# EAGLE design Adafruit CP2104 Friend (EAGLE 6.4)
COMPANY: ADAFRUIT INDUSTRIES; DRAWN: KTOWN; REV: A
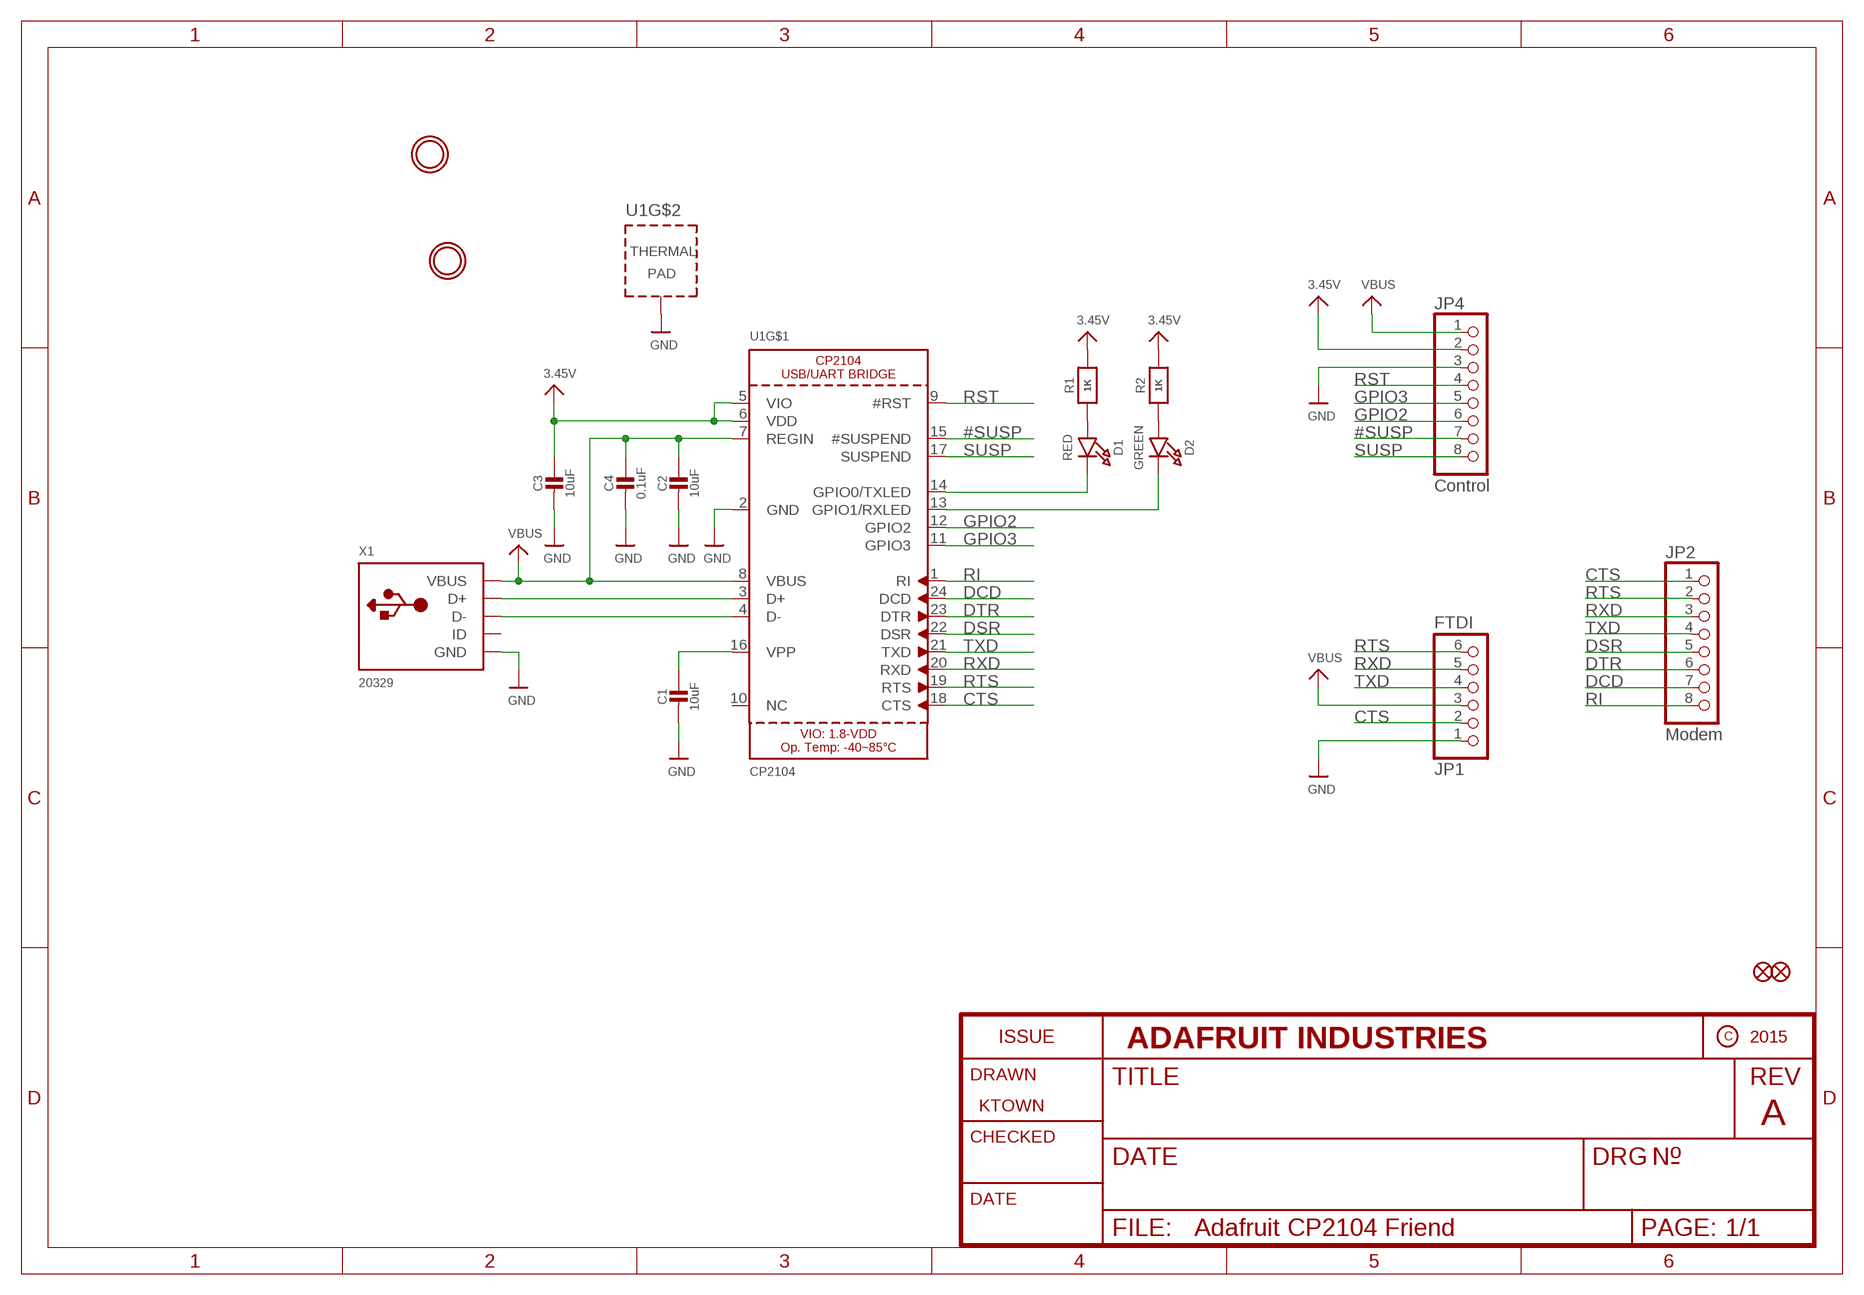
[diagram p0: schematic, sheet 1]

## Parts
C1  10uF  CAP_CERAMIC0805-NOOUTLINE  [0805-NO]
C2  10uF  CAP_CERAMIC0805-NOOUTLINE  [0805-NO]
C3  10uF  CAP_CERAMIC0805-NOOUTLINE  [0805-NO]
C4  0.1uF  CAP_CERAMIC0805-NOOUTLINE  [0805-NO]
D1  RED  LED0805_NOOUTLINE  [CHIPLED_0805_NOOUTLINE]
D2  GREEN  LED0805_NOOUTLINE  [CHIPLED_0805_NOOUTLINE]
FID1  FIDUCIAL""  [FIDUCIAL_1MM]
FID2  FIDUCIAL""  [FIDUCIAL_1MM]
JP1  FTDI  HEADER-1X676MIL  [1X06_ROUND_76]
JP2  Modem  HEADER-1X870MIL  [1X08_ROUND_70]
JP4  Control  HEADER-1X870MIL  [1X08_ROUND_70]
R1  1K  RESISTOR0805_NOOUTLINE  [0805-NO]
R2  1K  RESISTOR0805_NOOUTLINE  [0805-NO]
U1  CP2104  [QFN24_4MM_SMSC]
U$18  MOUNTINGHOLE2.0  [MOUNTINGHOLE_2.0_PLATED]
U$19  MOUNTINGHOLE2.0  [MOUNTINGHOLE_2.0_PLATED]
X1  20329  USB_MICRO_20329_V2  [4UCONN_20329_V2]

## Nets
3.3V: C3.1 JP4.2 R1.2 R2.2 U1.5(VIO) U1.6(VDD) ; supply symbol labelled 3.45V
#SUSP: JP4.7 U1.15(#SUSPEND)
CTS: JP1.2 JP2.1 U1.18(CTS)
DCD: JP2.7 U1.24(DCD)
DSR: JP2.5 U1.22(DSR)
DTR: JP2.6 U1.23(DTR)
GND: C1.2 C2.2 C3.2 C4.2 JP1.1 JP4.3 U1.2(GND) U1.THERM(TP) X1.BASE@1(GND) X1.BASE@2(GND) X1.GND X1.SPRT@1(GND) X1.SPRT@2(GND) X1.SPRT@3(GND) X1.SPRT@4(GND)
GPIO2: JP4.6 U1.12(GPIO2)
GPIO3: JP4.5 U1.11(GPIO3)
N$1: D1.A R1.1
N$2: U1.3(D+) X1.D+
N$3: U1.4(D-) X1.D-
N$4: C1.1 U1.16(VPP)
N$5: D2.A R2.1
N$6: D1.C U1.14(GPIO0/TXLED)
N$7: D2.C U1.13(GPIO1/RXLED)
RI: JP2.8 U1.1(RI)
RST: JP4.4 U1.9(#RST)
RTS: JP1.6 JP2.2 U1.19(RTS)
RXD: JP1.5 JP2.3 U1.20(RXD)
SUSP: JP4.8 U1.17(SUSPEND)
TXD: JP1.4 JP2.4 U1.21(TXD)
VBUS: C2.1 C4.1 JP1.3 JP4.1 U1.7(REGIN) U1.8(VBUS) X1.VBUS
Unconnected: U1.10(NC) X1.ID

## Library data of the parts
C1-C4 = microbuilder:CAP_CERAMIC: Ceramic Capacitors For new designs, use the packages preceded by an '_' character since they are more reliable: The following footprints should be used on most boards: _0402 - Standard footprint for regular board layouts _0603 - Standard footprint for regular board layouts _0805 - Standard footprint for regular board layouts _1206 - Standard footprint for regular board layouts For extremely tight-pitch boards where space is at a premium, the following 'micro-pitch' footprints can be used (smaller pads, no silkscreen outline, etc.): _0402MP - Micro-pitch footprint for very dense/compact boards _0603MP - Micro-pitch footprint for very dense/compact boards _0805MP - Micro-pitch footprint for very dense/compact boards _1206MP - Micro-pitch footprint for very dense/compact boards
D1 D2 = microbuilder:LED: LED 0603 - 0603 Surface Mount Package 2mA: Green LED - Low Power (3.9mcd, 2ma, 1.7Vf) - Digikey: 475-2709-2-ND Orange LED - Low Power (9.8mcd, 2ma, 1.8Vf) - Digikey: 475-1194-2-ND Red LED - Low Power (5mcd, 2ma, 1.8Vf) - Digikey: 475-1195-2-ND Yellow LED - Low Power (7mcd, 2ma, 1.8Vf) - Digikey: 475-1196-2-ND 5mA: Blue LED - Low Power (17mcd, 5ma, 2.9Vf) - Digikey: LNJ937W8CRACT-ND 0805 - 0805 Surface Mount Package 2mA: Red LED (8.8mcd, 2mA, 1.8Vf, Clear) - Low Power [Digikey: 475-2510-1-ND] Green LED (5mcd, 2mA, 1.8Vf, Clear) - Low Power [Digikey: 475-2730-1-ND] Yellow LED (11.3mcd, 2mA, 1.8Vf, Clear) - Low Power [Digikey: 475-2555-1-ND] 20mA: Red LED (104mcd, 20mA, Diffused) - LS R976 [Digikey: 475-1278-6-ND] Red LED (12mcd, 20mA, 2.0Vf, Clear) - APT2012EC [Digikey: 754-1128-1-ND] Green LED (15mcd, 20mA, 2.2Vf, Clear) - APT2012GC [Digikey: 754-1131-1-ND] Orange LED (160mcd, 20mA, 2.1Vf, Clear) - APT2012SECK [Digikey: 754-1130-1-ND] 1206 - 1206 Surface Mount Package Green LED (26mcd, 20mA, Diffused) - LG N971 [Digikey: 475-1407-6-ND] Red LED (15mcd, 20mA, Diffused) - LH N974 [Digikey: 475-1416-6-ND] Cree - Cree High-Power Surface Mount LEDs XPEBWT-L1-0000-00D50 - White 111lm 350mA 2.9Vf 6200K 110° XTEAWT-00-0000-00000LEE3 - White 114lm 350mA 2.85Vf 5000K 115° Everlight - Everlight 45-21 Series Surface Mount LEDs 45-21/QK2C-B2832AC2CB2/2T - Warm White 2000mcd 20mA 3.25Vf 3050K 120° 45-21/LK2C-B38452C4CB2/2T - Nuetral White 2000mcd 20mA 3.25Vf 4150K 120° 45-21/LK2C-B50634C6CB2/2T - Cold White 2200mcd 20mA 3.25Vf 5650K 120° PLCC2 Reverse Mount LS T77K-J1L2-1-0-2-R18-Z - Red 11.25mcd 2mA 1.8Vf 630nm 120° LO T77K-L1M2-24-Z - Orange 19.6mcd 2mA 1.8Vf 606nm 120° LY T77K-K2M1-26-Z - Yellow 15.7mcd 2mA 1.8Vf 587nm 120°
FID1 FID2 = microbuilder:FIDUCIAL: Fiducial Alignment Points Various fiducial points for machine vision alignment.; BOM: EXCLUDE
JP1 = microbuilder:HEADER-1X6: PIN HEADER
JP2 JP4 = microbuilder:HEADER-1X8: PIN HEADER
R1 R2 = microbuilder:RESISTOR: Resistors For new designs, use the packages preceded by an '_' character since they are more reliable: The following footprints should be used on most boards: _0402 - Standard footprint for regular board layouts _0603 - Standard footprint for regular board layouts _0805 - Standard footprint for regular board layouts _1206 - Standard footprint for regular board layouts For extremely tight-pitch boards where space is at a premium, the following 'micro-pitch' footprints can be used (smaller pads, no silkscreen outline, etc.): _0402MP - Micro-pitch footprint for very dense/compact boards _0603MP - Micro-pitch footprint for very dense/compact boards _0805MP - Micro-pitch footprint for very dense/compact boards _1206MP - Micro-pitch footprint for very dense/compact boards
U1 = microbuilder:CP2104: CP2104 - USB to UART Bridge VDD Output: 3.45V
U$18 U$19 = microbuilder:MOUNTINGHOLE: Mounting Hole For #2 screws (0.086"/2.18mm width, 0.094"/2.4mm hole) use 2.5mm; BOM: EXCLUDE
X1 = microbuilder:USB: USB Connectors USBMINIB - Surface Mount Female Mini-B USB Connector 4UConnector: 06564

## Board
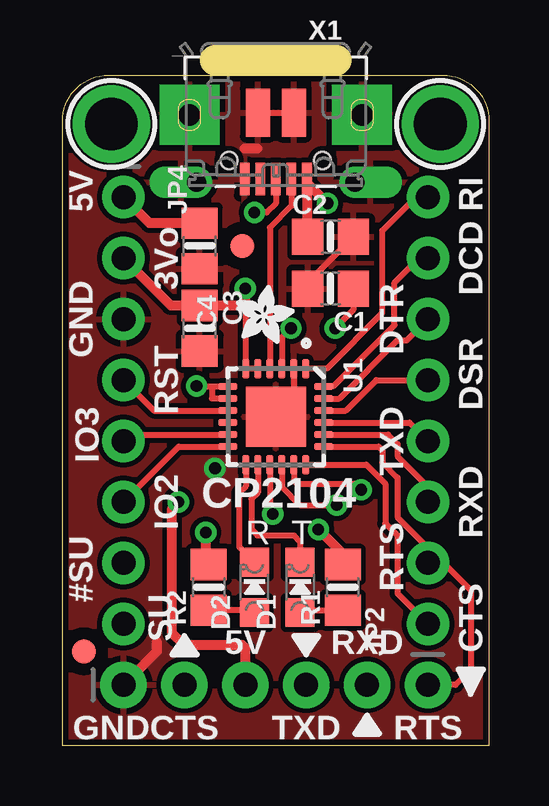
[diagram p1: board, top side]
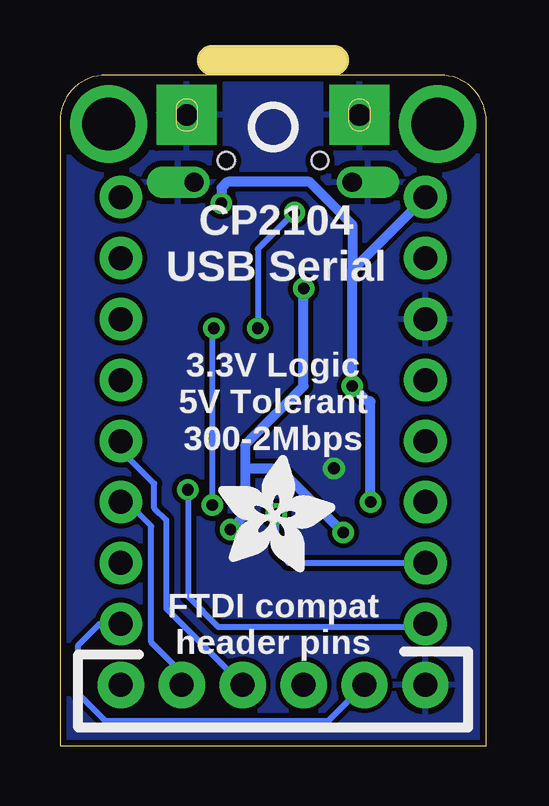
[diagram p2: board, bottom side, seen from below]

Size 17.78 x 28.57 mm. Coordinates in mm from the lower left corner, seen from the top.
Outline: 6.35,28.57 11.43,28.57
Outline: 0,0 0,26.04 arc-90 1.91,27.94 15.88,27.94 arc-90 17.78,26.04 17.78,0 0,0
Copper layers (1*16): Top 0.035mm / dielectric 1.5mm / Bottom 0.035mm
Design rules "adafruit *": minimum track width 8mil, minimum drill 15.5mil, track to track 8mil, track to pad 8mil, pad to pad 8mil, via to via 8mil, smd to smd 8mil, copper to edge 10mil, drill to drill 8mil, minimum pad ring 10mil, minimum via ring 8mil, stop-mask expansion 2mil, vias tented up to drill 20mil, thermal gap 10mil

### Footprints (pad centres in the part's own frame; a part is rotated, then mirrored left to right if it is on the bottom)
0805-NO = smd 1.3 x 1.5: 1 -0.95,0; 2 0.95,0
CHIPLED_0805_NOOUTLINE = smd 1.2 x 1.2: A 0,-1.05; C 0,1.05
FIDUCIAL_1MM = smd 1 x 1: 1 0,0
1X06_ROUND_76 = drill 1 pad 1.93: 1 -6.35,0; 2 -3.81,0; 3 -1.27,0; 4 1.27,0; 5 3.81,0; 6 6.35,0
1X08_ROUND_70 = drill 1 pad 1.778: 1 -8.89,0; 2 -6.35,0; 3 -3.81,0; 4 -1.27,0; 5 1.27,0; 6 3.81,0; 7 6.35,0; 8 8.89,0
QFN24_4MM_SMSC = smd 0.8 x 0.28: 1 -2,1.25; 2 -2,0.75; 3 -2,0.25; 4 -2,-0.25; 5 -2,-0.75; 6 -2,-1.25; 13 2,-1.25; 14 2,-0.75; 15 2,-0.25; 16 2,0.25; 17 2,0.75; 18 2,1.25 | smd 0.28 x 0.8: 7 -1.25,-2; 8 -0.75,-2; 9 -0.25,-2; 10 0.25,-2; 11 0.75,-2; 12 1.25,-2; 19 1.25,2; 20 0.75,2; 21 0.25,2; 22 -0.25,2; 23 -0.75,2; 24 -1.25,2 | smd 2.5 x 2.5: THERM 0,0
MOUNTINGHOLE_2.0_PLATED = drill 2.2 pad 3: P$1 0,0
4UCONN_20329_V2 = smd 1 x 2: BASE@1 -0.75,-2; BASE@2 0.75,-2 | smd 0.4 x 1.35: D+ 0,0.775; D- -0.65,0.775; GND 1.3,0.775; ID 0.65,0.775; VBUS -1.3,0.775 | drill 0.8 pad 1.2 offset: SPRT@1 -3.3,0.9; SPRT@2 3.3,0.9 | drill 0.9 pad 2.5 square: SPRT@3 -3.6,-1.9; SPRT@4 3.6,-1.9 | hole 0.7: -1.95,0; 1.95,0

### Placement (x,y rotation side)
C1  11.18,19.05 180 top
C2  11.18,21.21 0 top
C3  5.71,17.4 270 top
C4  5.71,20.83 270 top
D1  9.91,6.6 0 top
D2  8,6.6 0 top
FID1  0.89,3.94 0 top
FID2  7.49,20.83 0 top
JP1  8.89,2.54 0 top
JP2  15.24,13.97 90 top
JP4  2.54,13.97 270 top
R1  11.68,6.6 90 top
R2  6.1,6.6 90 top
U1  8.89,13.72 270 top
U$8  [ADAFRUIT_2.5MM]  7.24,16.76 0 top
U$17  [PCBFEAT-REV-040]  8.89,25.78 0 bottom
U$18  15.75,25.91 0 top
U$19  2.03,25.91 0 top
U$22  [ADAFRUIT_5MM]  11.18,7.24 0 bottom
X1  8.89,24.38 180 top

### Tracks (layer width: path | path; a pad name or v marks a point on that pad's centre or on a via)
3.3V  (via drill 0.48)
  Top 0.254: U1.5 U1.6 7.64,19.03 v7.62,19.05
  Top 0.406: R1.2 11.68,8 v10.67,9.02 | v5.97,8.89 5.97,7.68 R2.2 | JP4.2 4.51,18.35 C3.1 7.62,18.35 v7.62,19.05
  Bottom 0.406: v5.97,8.89 8.64,11.56 9.91,11.56 10.03,11.68 | v10.67,9.02 10.03,9.65 10.03,11.68 | 10.03,11.68 10.03,12.57 7.62,14.99 v7.62,19.05
#SUSP  (via drill 0.48)
  Top 0.254: U1.15 8.64,9.78 v8.76,9.65
  Bottom 0.254: v8.76,9.65 8.76,8.13 8.26,7.62 JP4.7
CTS
  Top 0.254: U1.18 12.67,11.72 13.46,10.92 13.46,9.27 13.97,8.76 13.97,6.35 JP2.1
  Bottom 0.254: JP1.2 6.6,1.02 15.88,1.02 17.02,2.16 17.02,4.19 16.13,5.08 JP2.1
DCD
  Top 0.254: JP2.7 14.86,20.32 13.84,19.3 13.84,17.53 11.3,14.99 10.91,14.99 U1.24
DSR
  Top 0.254: U1.22 11.81,13.97 13.08,15.24 JP2.5
DTR
  Top 0.254: U1.23 11.54,14.47 13.97,16.89 14.35,16.89 JP2.6
GND  (via drill 0.5)
  Top 0.254: 9.74,26.28 X1.BASE@1 X1.BASE@2 | C1.2 10.23,19.31 C2.2 | U1.2 9.64,13.72 U1.THERM
  Top 0.406: JP1.1 3.94,3.94 3.94,4.32 | 7.59,24.89 8.13,24.89
  other vias: 6.35,11.56
  pour Top: 17.78,27.94 0,27.94 0,0 17.78,0
  pour Bottom: 17.78,27.94 0,27.81 0,0 17.78,0
GPIO2
  Top 0.254: JP4.6 4.85,12.47 U1.12
GPIO3
  Top 0.254: JP4.5 2.81,12.97 U1.11
N$1
  Top 0.254: D1.A 10.01,5.65 R1.1
N$2  (via drill 0.48)
  Top 0.254: X1.D+ 8.89,22.61 8.51,22.23 v8,22.23 | v9.53,17.4 9.14,17.01 U1.3
  Bottom 0.254: v8,22.23 9.53,20.7 v9.53,17.4
N$3
  Top 0.254: X1.D- 9.54,22.49 8.64,21.59 U1.4
N$4  (via drill 0.48)
  Top 0.254: U1.16 9.14,10.8 9.91,10.03 v11.43,10.03 | C1.1 12.13,18.16 v11.36,17.4
  Bottom 0.254: v11.36,17.4 11.43,17.33 v11.43,10.03
N$5
  Top 0.254: D2.A 7.9,5.65 R2.1
N$6
  Top 0.254: U1.14 8.14,10.55 7.87,10.29 7.87,9.02 8.13,8.76 9.65,8.76 9.91,8.51 D1.C
N$7
  Top 0.254: U1.13 7.64,10.81 7.37,10.54 7.37,8.29 D2.C
RI
  Top 0.254: JP2.8 14.73,22.86 13.34,21.46 13.34,18.03 11.02,15.72 U1.1
RST
  Top 0.254: JP4.4 3.81,13.97 U1.9
RTS
  Top 0.254: U1.19 13.19,12.47 13.34,12.32 13.34,11.81 13.97,11.18 13.97,9.53 15.24,8.26 JP2.2 15.88,7.62 17.02,6.48 17.02,3.17 16.38,2.54 JP1.6
RXD
  Top 0.254: U1.20 13.58,12.97 13.97,12.57 13.97,12.06 15.24,10.79 JP2.3
  Bottom 0.254: JP1.5 12.7,3.05 13.97,4.32 13.97,9.14 14.99,10.16 JP2.3
SUSP  (via drill 0.48)
  Top 0.254: v12.45,10.67 12.19,10.92 9.77,10.92 9.64,11.05 U1.17
  Bottom 0.254: v12.45,10.67 12.45,6.22 11.18,4.95 2.67,4.95 JP4.8
TXD
  Top 0.254: U1.21 14.47,13.47 JP2.4
  Bottom 0.254: JP1.4 13.34,5.71 13.34,9.4 13.84,9.91 13.84,10.92 15.24,12.32 JP2.4
VBUS  (via drill 0.48)
  Top 0.254: 10.19,23.46 X1.VBUS | 6.22,14.97 6.22,14.48 U1.8 | U1.7 6.22,14.97 | 6.22,14.97 5.61,14.97 v5.59,14.99
  Top 0.406: v11.05,22.61 10.19,23.46 | JP1.3 7.62,4.06 7.49,4.19 5.08,4.19 4.57,4.7 4.57,9.91 v4.83,10.16 | X1.VBUS 10.19,21.25 C2.1 | C4.1 3.62,21.78 JP4.1
  Bottom 0.406: v11.05,22.61 11.05,23.24 10.79,23.5 7.37,23.5 5.59,21.72 5.59,19.81 | 5.59,19.81 v5.59,14.99 4.95,14.35 4.83,14.35 v4.83,10.16 | 5.59,19.81 JP4.1

### Text on the board
tPlace: 5V | RI | 3Vo | DCD | GND | DTR | RST | DSR | IO3 | TXD | CP2104 | IO2 | RXD | R | T | RTS | #SU | SU | CTS | 5V | RXD | GND | CTS | TXD | RTS
bPlace: CP2104 / USB Serial | 3.3V Logic / 5V Tolerant / 300-2Mbps | FTDI compat / header pins